# EAGLE schematic project (EAGLE 9.1.3)

## Sheet 1 of 2: Wifi
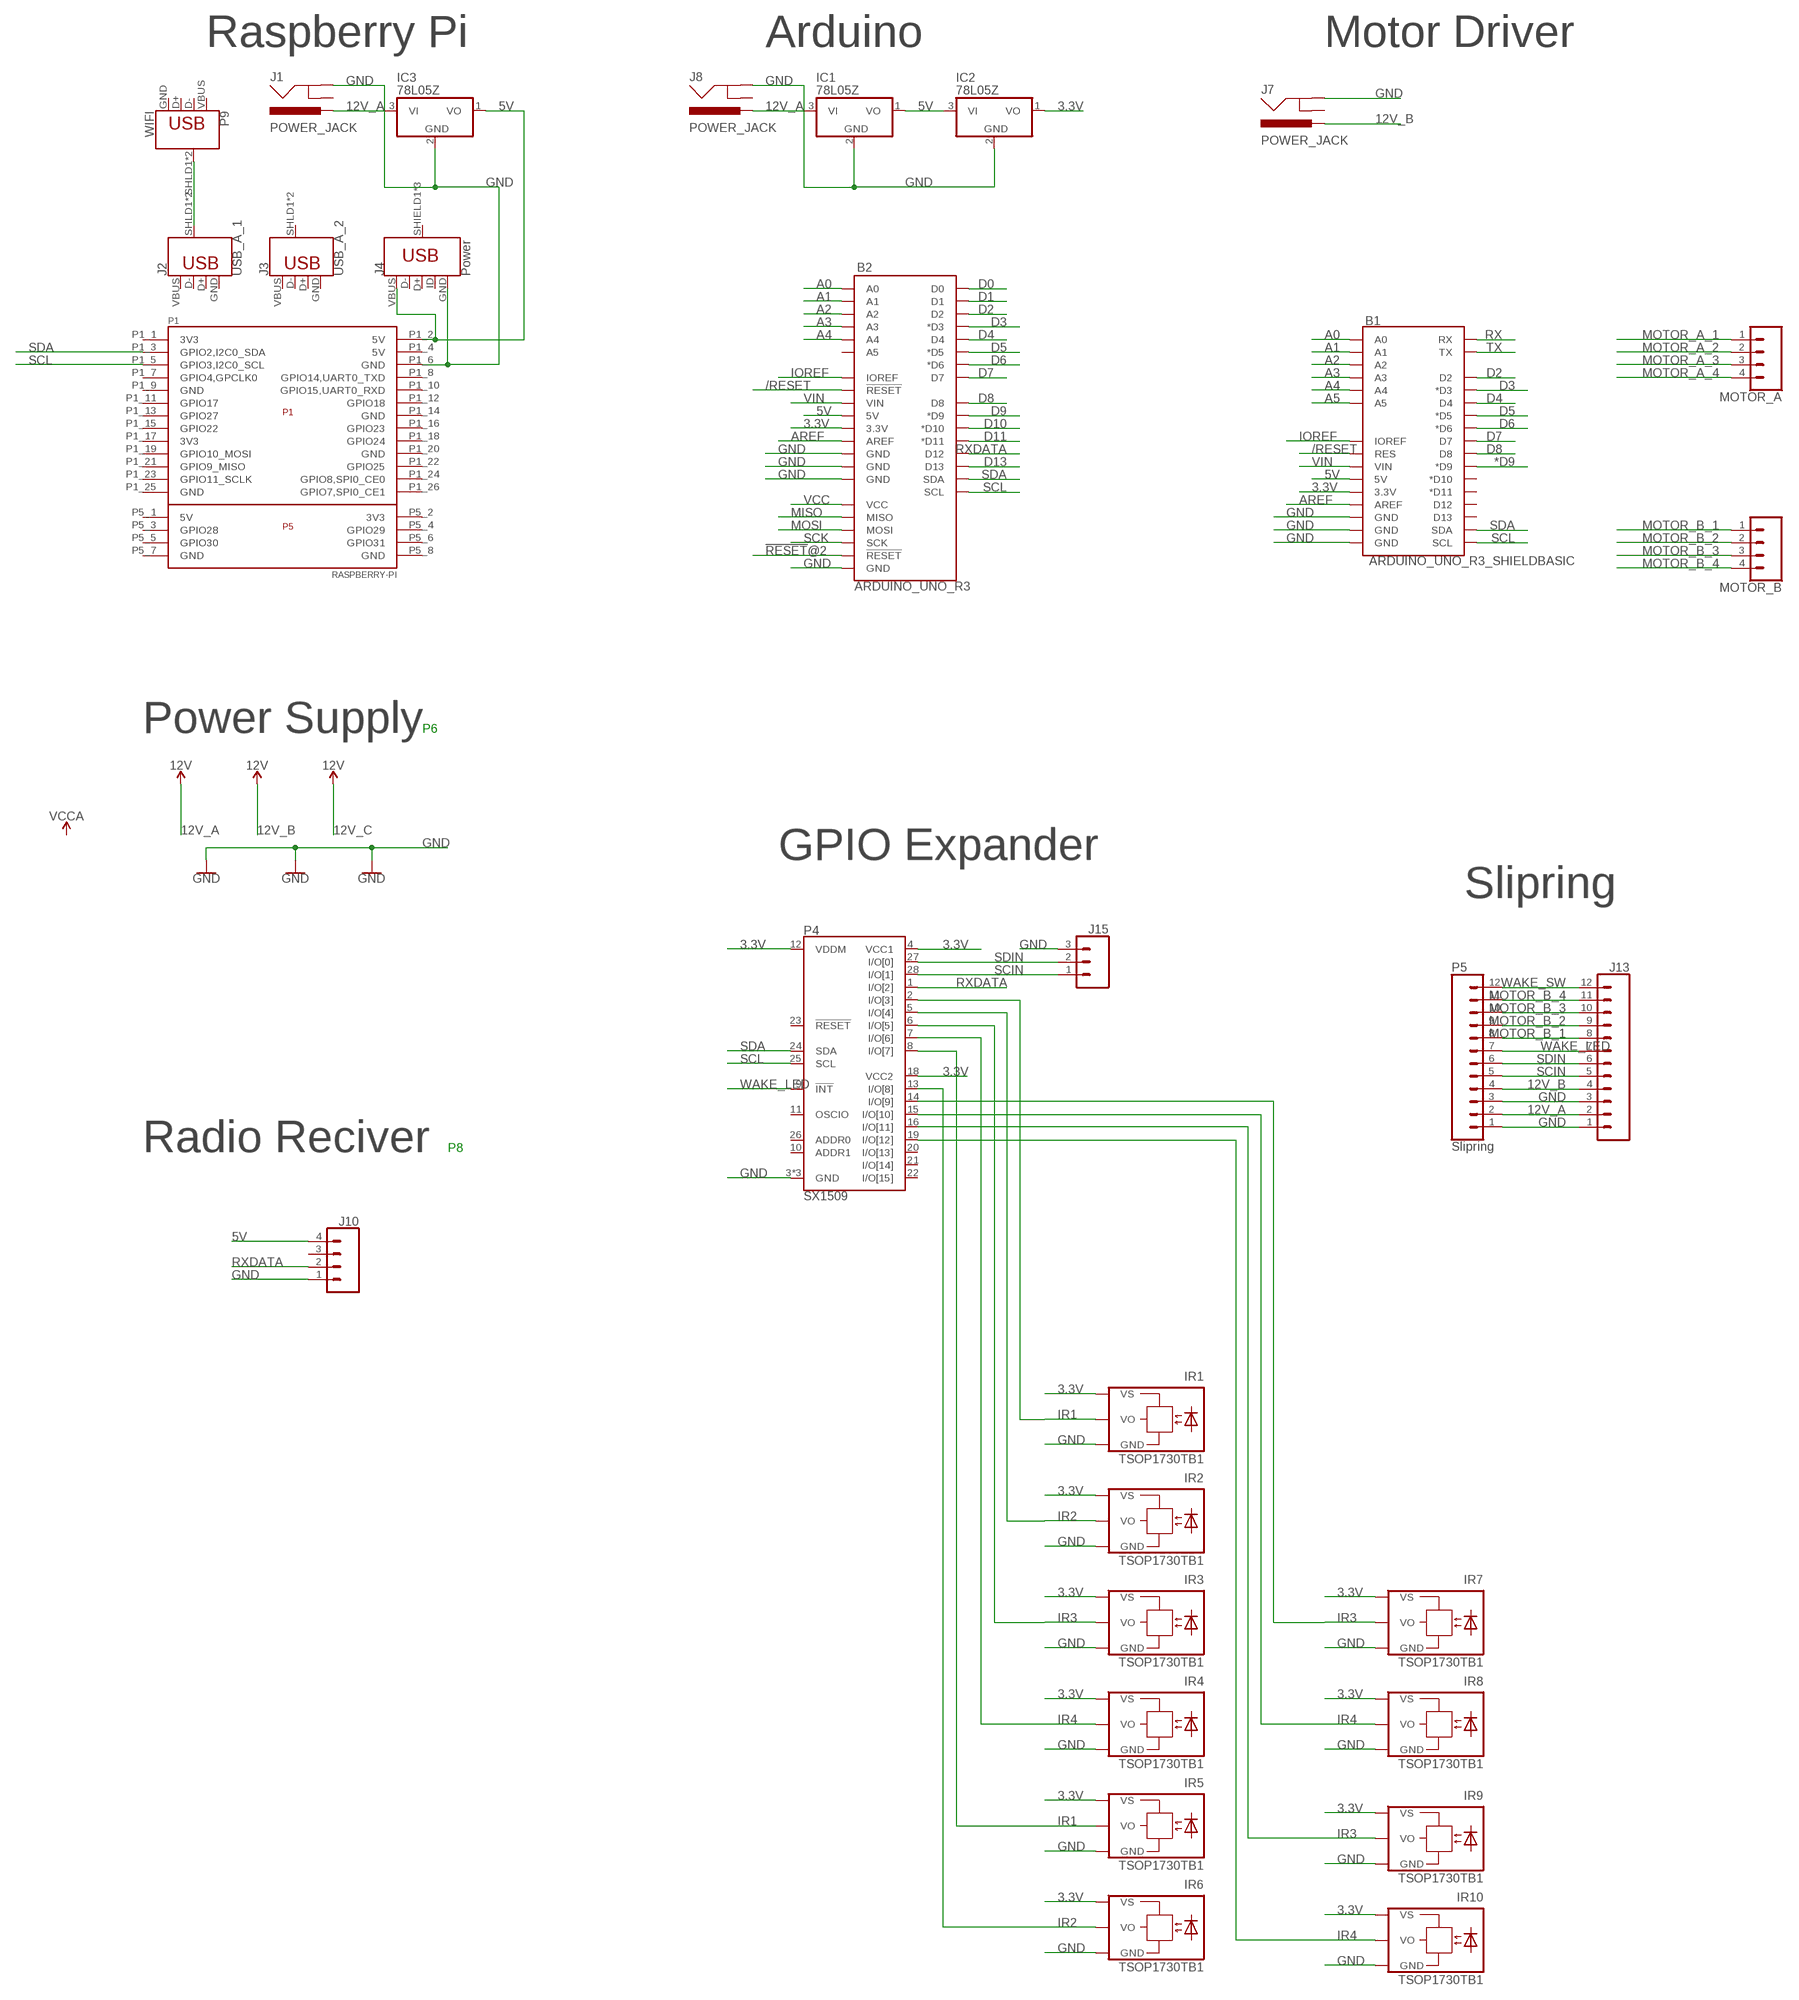
[diagram p0: schematic, sheet 1, part 1 of 2]
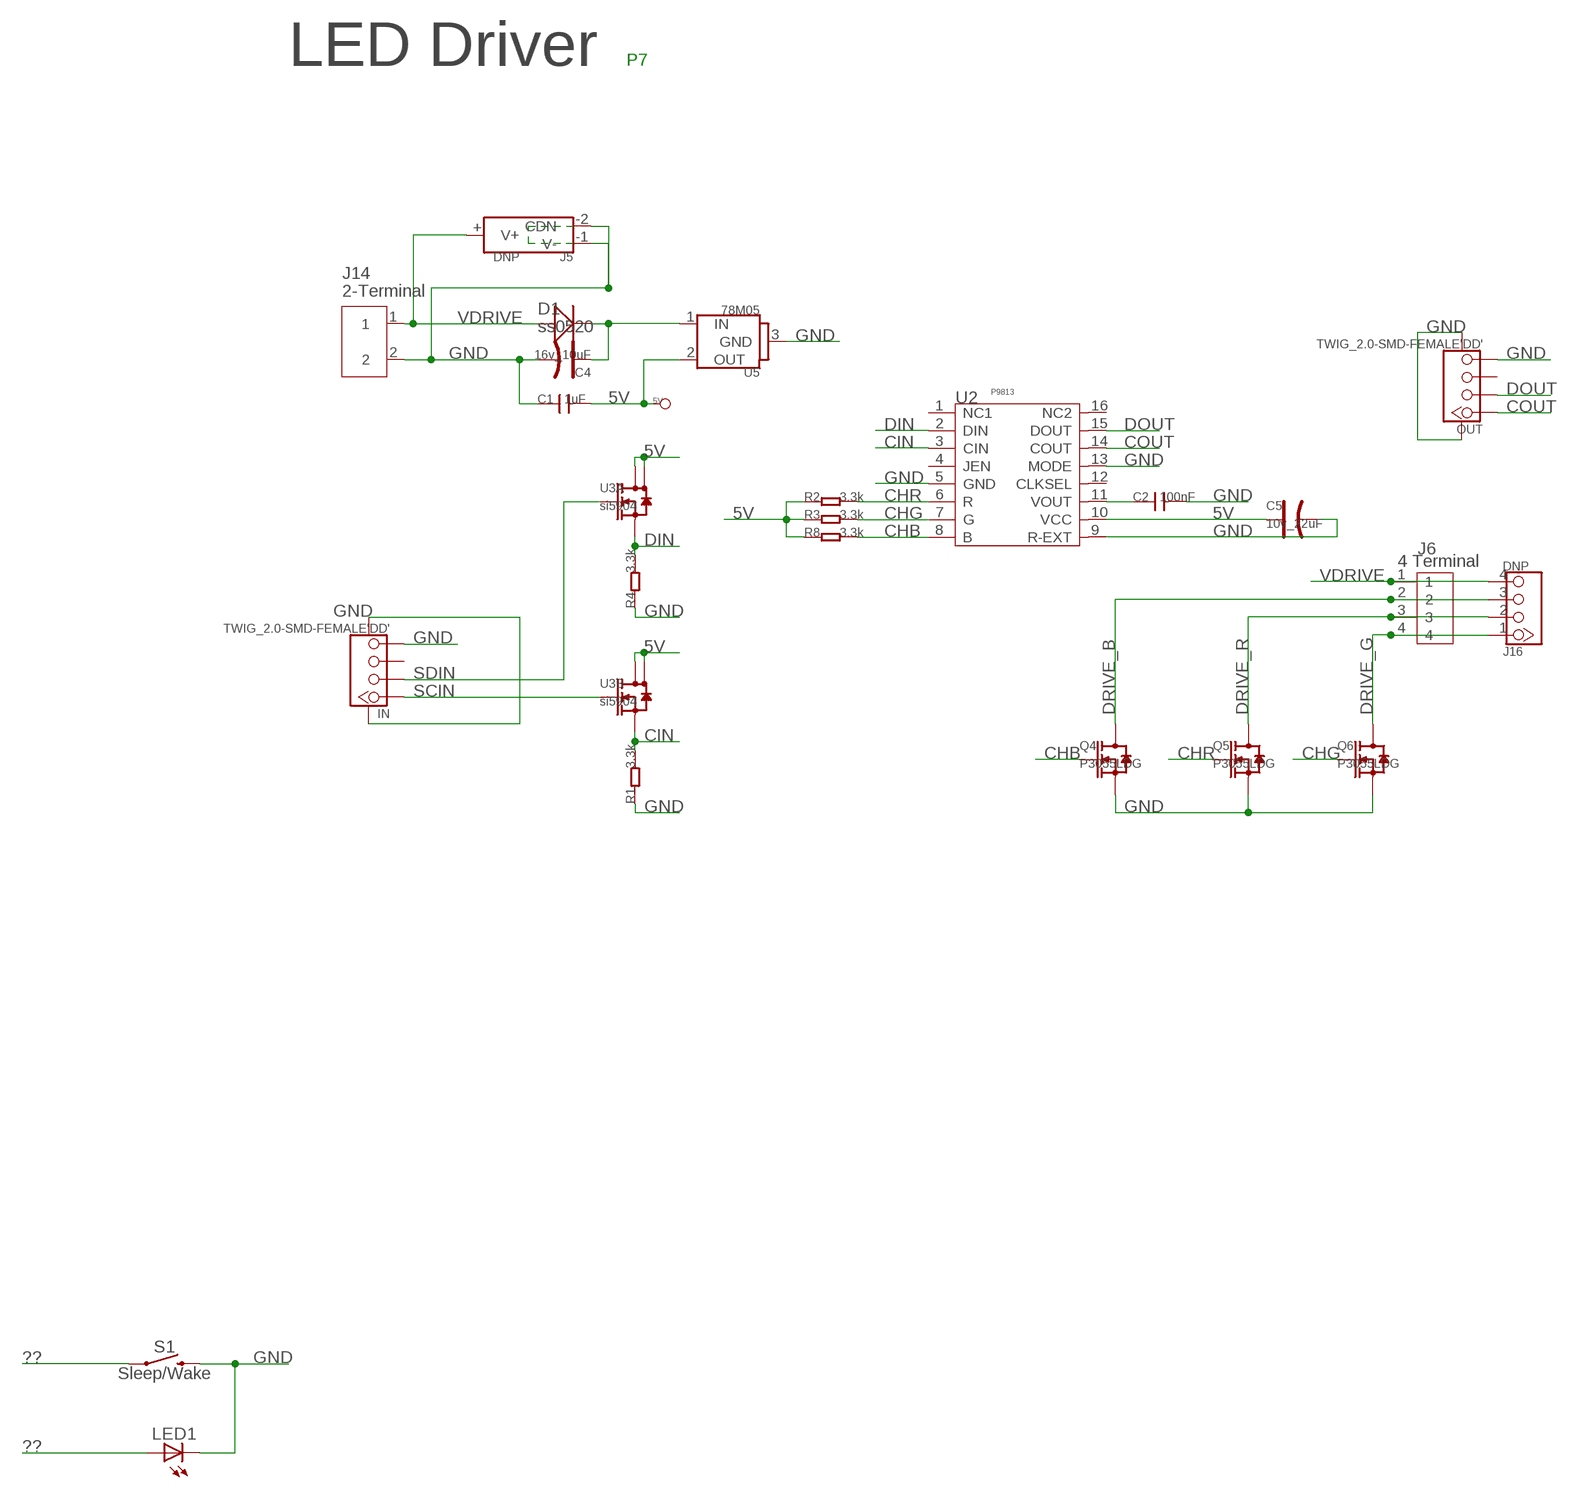
[diagram p1: schematic, sheet 1, part 2 of 2]

### Parts
5V  DNP  PAD-TEST-POINT-CIRCLE_SIZE_3030  [TP_3535]
B1  ARDUINO_UNO_R3_SHIELDBASIC  [UNO_R3_SHIELD]
B2  ARDUINO_UNO_R3  [ARDUINO_R3]
C1  1uF  C-0805  [0805]
C2  100nF  C-0402  [0402]
C4  16v_10uF  CAP-AVX-A  [AVX-A]
C5  10v_22uF  CAP-AVX-A  [AVX-A]
D1  ss0520  D'1206'  [SOD123]
IC1  78L05Z  [TO92]
IC2  78L05Z  [TO92]
IC3  78L05Z  [TO92]
IN  TWIG_2.0-SMD-FEMALE'DD'  [2.0_1X4DD]
IR1  TSOP1730TB1  [TSOP17_TB1]
IR2  TSOP1730TB1  [TSOP17_TB1]
IR3  TSOP1730TB1  [TSOP17_TB1]
IR4  TSOP1730TB1  [TSOP17_TB1]
IR5  TSOP1730TB1  [TSOP17_TB1]
IR6  TSOP1730TB1  [TSOP17_TB1]
IR7  TSOP1730TB1  [TSOP17_TB1]
IR8  TSOP1730TB1  [TSOP17_TB1]
IR9  TSOP1730TB1  [TSOP17_TB1]
IR10  TSOP1730TB1  [TSOP17_TB1]
J1  POWER_JACK  [POWER_JACK_PTH]
J2  USB_A_1  USB_A_SMT_FEMALE  [USB-A-S-SILK-FEMALE]
J3  USB_A_2  USB_A_SMT_FEMALE  [USB-A-S-SILK-FEMALE]
J4  Power  USB_MICRO-B_FEMALE-SMT  [USB-B-MICRO-SMD]
J5  DNP  JACK-3P-2.5MM-2.5MM  [PW-3P-2.5]
J6  4 Terminal  SCREW-TERMINAL-4P'2.54'  [4P-2.54-15.6X12.2X13.2]
J7  POWER_JACK  [POWER_JACK_PTH]
J8  POWER_JACK  [POWER_JACK_PTH]
J10  CONN_04  [1X04]
J13  CONN_12  [1X12]
J14  2-Terminal  SCREW-TERMINAL-2P'2.54'  [2P-2.54-12.1X8.5X13.4]
J15  CONN_03  [1X03]
J16  DNP  HEADER-4P-90D  [4P-2.54-90]
LED1  LED5MM  [LED5MM]
MOTOR_A  CONN_04SCREW  [SCREWTERMINAL-3.5MM-4]
MOTOR_B  CONN_04SCREW  [SCREWTERMINAL-3.5MM-4]
OUT  TWIG_2.0-SMD-FEMALE'DD'  [2.0_1X4DD]
P1  RASPBERRY-PI  RASPBERRY-PI_REV2  [RASPBERRY-PI_REV2]
P4  SX1509  [QFN-28]
P5  Slipring  CONN_12  [1X12]
P9  WIFI  USB_A_PTH_MALE  [USB-A-H]
Q4  P3055LDG  MOSFET-N-P3055LDG  [TO252]
Q5  P3055LDG  MOSFET-N-P3055LDG  [TO252]
Q6  P3055LDG  MOSFET-N-P3055LDG  [TO252]
R1  3.3k  R-0402  [0402]
R2  3.3k  R-0402  [0402]
R3  3.3k  R-0402  [0402]
R4  3.3k  R-0402  [0402]
R8  3.3k  R-0402  [0402]
S1  Sleep/Wake  MOMENTARY-SWITCH-SPST-PTH-6.0MM  [TACTILE_SWITCH_PTH_6.0MM]
U2  P9813  P9813-SSOP16  [SSOP16]
U3  si5904  MOSFET-DUAL-N-1206-8  [1206-8]
U5  78M05  78M05-TO252  [TO252]

### Nets
3.3V: B1.3.3V B2.3.3V IC2.1(VO) IR1.VS IR2.VS IR3.VS IR4.VS IR5.VS IR6.VS IR7.VS IR8.VS IR9.VS IR10.VS P4.4(VCC1) P4.12(VDDM) P4.18(VCC2)
5V: 5V.T B1.5V B2.5V C1.2 C5.+ IC1.1(VO) IC2.3(VI) IC3.1(VO) J4.VBUS J10.4 P1.P1_2(5V) R2.1 R3.1 R8.1 U2.10(VCC) U3.5(B:D) U3.6(B:D) U3.7(A:D) U3.8(A:D) U5.2(OUT)
12V_A: IC1.3(VI) IC3.3(VI) J1.PWR J8.PWR J13.2 P5.2 ; supply symbol labelled 12V
12V_B: J7.PWR J13.4 P5.4 ; supply symbol labelled 12V
!RESET!@2: B2.RESET@2(!RESET!)
*D9: B1.D9(*D9)
/RESET: B1.RES B2.RESET@1(!RESET!)
??: LED1.A S1.1
A0: B1.A0 B2.A0
A1: B1.A1 B2.A1
A2: B1.A2 B2.A2
A3: B1.A3 B2.A3
A4: B1.A4 B2.A4
A5: B1.A5
AREF: B1.AREF B2.AREF
CHB: Q4.1(G) R8.2 U2.8(B)
CHG: Q6.1(G) R3.2 U2.7(G)
CHR: Q5.1(G) R2.2 U2.6(R)
CIN: R1.2 U2.3(CIN) U3.3(B:S)
COUT: OUT.1 U2.14(COUT)
D0: B2.D0
D1: B2.D1
D2: B1.D2 B2.D2
D3: B1.D3(*D3) B2.D3(*D3)
D4: B1.D4 B2.D4
D5: B1.D5(*D5) B2.D5(*D5)
D6: B1.D6(*D6) B2.D6(*D6)
D7: B1.D7 B2.D7
D8: B1.D8 B2.D8
D9: B2.D9(*D9)
D10: B2.D10(*D10)
D11: B2.D11(*D11)
D13: B2.D13
DIN: R4.2 U2.2(DIN) U3.1(A:S)
DOUT: OUT.2 U2.15(DOUT)
DRIVE_B: J6.2 J16.3 Q4.2(D)
DRIVE_G: J6.4 J16.1 Q6.2(D)
DRIVE_R: J6.3 J16.2 Q5.2(D)
GND: B1.GND@0(GND) B1.GND@1(GND) B1.GND@2(GND) B2.GND@1(GND) B2.GND@2(GND) B2.GND@3(GND) B2.GND@4(GND) C1.1 C2.2 C4.- C5.- IC1.2(GND) IC2.2(GND) IC3.2(GND) IN.4 IN.SS1 IN.SS2 IR1.GND IR2.GND IR3.GND IR4.GND IR5.GND IR6.GND IR7.GND IR8.GND IR9.GND IR10.GND J1.GND J4.GND J5.-1(V-) J5.-2(CDN) J7.GND J8.GND J10.1 J13.1 J13.3 J14.2 J15.3 LED1.K(C) OUT.4 OUT.SS1 OUT.SS2 P1.P1_6(GND) P4.3(GND) P4.17(GND) P4.29(GND) P5.1 P5.3 Q4.3(S) Q5.3(S) Q6.3(S) R1.1 R4.1 S1.3 U2.5(GND) U2.9(R-EXT) U2.13(MODE) U5.3(GND)
IOREF: B1.IOREF B2.IOREF
IR1: IR1.VO IR5.VO P4.2(I/O[3]) P4.8(I/O[7])
IR2: IR2.VO IR6.VO P4.5(I/O[4]) P4.13(I/O[8])
IR3: IR3.VO IR7.VO IR9.VO P4.6(I/O[5]) P4.14(I/O[9]) P4.16(I/O[11])
IR4: IR4.VO IR8.VO IR10.VO P4.7(I/O[6]) P4.15(I/O[10]) P4.19(I/O[12])
MISO: B2.MISO
MOSI: B2.MOSI
MOTOR_A_1: MOTOR_A.1
MOTOR_A_2: MOTOR_A.2
MOTOR_A_3: MOTOR_A.3
MOTOR_A_4: MOTOR_A.4
MOTOR_B_1: J13.8 MOTOR_B.1 P5.8
MOTOR_B_2: J13.9 MOTOR_B.2 P5.9
MOTOR_B_3: J13.10 MOTOR_B.3 P5.10
MOTOR_B_4: J13.11 MOTOR_B.4 P5.11
N$1: J2.SHLD1(SHIELD) J2.SHLD2(SHIELD) P9.SHLD1(SHIELD) P9.SHLD2(SHIELD)
N$11: C2.1 U2.11(VOUT)
N$12: C4.+ D1.- U5.1(IN)
RX: B1.RX
RXDATA: B2.D12 J10.2 P4.1(I/O[2])
SCIN: IN.1 J13.5 J15.1 P4.28(I/O[1]) P5.5 U3.4(B:G)
SCK: B2.SCK
SCL: B1.SCL B2.SCL P1.P1_5(GPIO3,I2C0_SCL) P4.25(SCL)
SDA: B1.SDA B2.SDA P1.P1_3(GPIO2,I2C0_SDA) P4.24(SDA)
SDIN: IN.2 J13.6 J15.2 P4.27(I/O[0]) P5.6 U3.2(A:G)
TX: B1.TX
VCC: B2.VCC
VDRIVE: D1.+ J5.+(V+) J6.1 J14.1 J16.4
VIN: B1.VIN B2.VIN
WAKE_LED: J13.7 P4.9(!INT) P5.7
WAKE_SW: J13.12 P5.12
Unconnected: B1.D10(*D10) B1.D11(*D11) B1.D12 B1.D13 B2.A5 IN.3 J1.GNDBREAK J2.D+ J2.D- J3.D+ J3.D- J3.SHLD1(SHIELD) J3.SHLD2(SHIELD) J4.D+ J4.D- J4.ID J4.SHIELD1(SHIELD) J4.SHIELD2(SHIELD) J4.SHIELD3(SHIELD) J7.GNDBREAK J8.GNDBREAK J10.3 OUT.3 P1.P1_1(3V3) P1.P1_4(5V) P1.P1_7(GPIO4,GPCLK0) P1.P1_8(GPIO14,UART0_TXD) P1.P1_9(GND) P1.P1_10(GPIO15,UART0_RXD) P1.P1_11(GPIO17) P1.P1_12(GPIO18) P1.P1_13(GPIO27) P1.P1_14(GND) P1.P1_15(GPIO22) P1.P1_16(GPIO23) P1.P1_17(3V3) P1.P1_18(GPIO24) P1.P1_19(GPIO10_MOSI) P1.P1_20(GND) P1.P1_21(GPIO9_MISO) P1.P1_22(GPIO25) P1.P1_23(GPIO11_SCLK) P1.P1_24(GPIO8,SPI0_CE0) P1.P1_25(GND) P1.P1_26(GPIO7,SPI0_CE1) P1.P5_1(5V) P1.P5_2(3V3) P1.P5_3(GPIO28) P1.P5_4(GPIO29) P1.P5_5(GPIO30) P1.P5_6(GPIO31) P1.P5_7(GND) P1.P5_8(GND) P4.10(ADDR1) P4.11(OSCIO) P4.20(I/O[13]) P4.21(I/O[14]) P4.22(I/O[15]) P4.23(!RESET) P4.26(ADDR0) P9.D+ P9.D- U2.1(NC1) U2.4(JEN) U2.12(CLKSEL) U2.16(NC2)

### Notes on the sheet
- Raspberry Pi | Arduino | Motor Driver | LED Driver | P7
- Power Supply | P6
- GPIO Expander
- Slipring
- Radio Reciver | P8

## Sheet 2 of 2

## Power pins joined to a net without a drawn wire
GND: J2.GND J3.GND P9.GND
VBUS: J2.VBUS J3.VBUS P9.VBUS

## Library data of the parts
5V = Discrete:PAD-TEST-POINT-CIRCLE
B1 = SparkFun-Boards:ARDUINO_UNO_R3_SHIELD: Arduino R3 Shield Footprint Shield form compatible with the Arduino Uno R3. SparkFun Products: MG2639 Cellular Shield <https://www.sparkfun.com/products/13120> MIDI Shield <https://www.sparkfun.com/products/12898> R3 Stackable Headers Kit <https://www.sparkfun.com/products/11417>
B2 = SparkFun-Boards:ARDUINO_UNO_R3: Arduino R3 Footprint with SPI header Arduino Uno R3 Compatible Footprint. Matches PCB size of the original board. SparkFun Products: SAMD21 Dev Breakout <https://www.sparkfun.com/products/13672> RedBoard <https://www.sparkfun.com/products/12757> R3 Stackable Headers <https://www.sparkfun.com/products/11417>
C1 C2 = Discrete:C*: Ceramic Capacitors
C4 C5 = Discrete:CAP*: Electrolytic Capacitors,Tantalum Capacitors and Super Capacitors
D1 = Discrete:D*
IC1-IC3 = adafruit:78*: Positive VOLTAGE REGULATOR Added bigger pads to the TO-92 package
IN OUT = Connector:TWIG_2.0-SMD-FEMALE
IR1-IR10 = telefunken:TSOP17*TB1: TSOP17..TB1 IR Receiver Modules for Remote Control Systems Source: http://www.vishay.com/docs/82042/82042.pdf; OC_FARNELL: unknown; OC_NEWARK: unknown
J1 J7 J8 = SparkFun-Connectors:POWER_JACK: Power Jack Connector This is the standard 5.5mm barrel jack for power. The PTH is the most common, proven, reliable, footprint. The Slot footprint only works if the mill layer is transmitted to the PCB fab house so be warned. Here are the connectors we sell at SparkFun: DC Barrel Power Jack/Connector <https://www.sparkfun.com/products/119> (PRT-00119) DC Barrel Power Jack/Connector (SMD) <https://www.sparkfun.com/products/12748> (PRT-12748) DC Barrel Jack Adapter - Breadboard Compatible <https://www.sparkfun.com/products/10811> (PRT-10811) It is used on this SparkFun product (and many, many others): SparkFun RedBoard - Programmed with Arduino <https://www.sparkfun.com/products/12757> (DEV-12757) Also, if you need a mating power supply or connector, please check these out: Wall Adapter Power Supply - 9VDC 650mA <https://www.sparkfun.com/products/298> (TOL-00298) DC Barrel Jack Adapter - Male <https://www.sparkfun.com/products/10287> (PRT-10287); PROD_ID: CONN-08197
J2 J3 = SparkFun-Connectors:USB_A: USB-A Connector Male and female variants, as well as PTH and SMT variants SparkFun Products: SparkFun XBee Explorer Dongle <https://www.sparkfun.com/products/11697> PTH Male SparkFun MicroView-USB Programmer <https://www.sparkfun.com/products/12924> SMT Male SparkFun USB Type A Female Breakout <https://www.sparkfun.com/products/12700> SMT Female; PROD_ID: CONN-09520; SF_ID: PRT-09011
J4 = SparkFun-Connectors:USB_MICRO-B: USB Type Micro-B Connector Male/female and PTH/SMT variants SparkFun Products: SparkFun microB USB Breakout <https://www.sparkfun.com/products/12035> SparkFun USB microB Plug Breakout <https://www.sparkfun.com/products/10031> SparkFun ESP8266 Thing <https://www.sparkfun.com/products/13231>; PROD_ID: CONN-11752
J5 = Connector:JACK-3P-2.5MM
J6 = Connector:SCREW-TERMINAL-4P
J10 = SparkFun-Connectors:CONN_04: Multi connection point. Often used as Generic Header-pin footprint for 0.1 inch spaced/style header connections On any of the 0.1 inch spaced packages, you can populate with these: Break Away Headers - Straight <https://www.sparkfun.com/products/116> (PRT-00116) Break Away Male Headers - Right Angle <https://www.sparkfun.com/products/553> (PRT-00553) Female Headers <https://www.sparkfun.com/products/115> (PRT-00115) Break Away Headers - Machine Pin <https://www.sparkfun.com/products/117> (PRT-00117) Break Away Female Headers - Swiss Machine Pin <https://www.sparkfun.com/products/743> (PRT-00743) For SCREWTERMINALS and SPRING TERMINALS visit here: Screw Terimnals on SparkFun.com <https://www.sparkfun.com/search/results?term=Screw+Terminals> (5mm/3.5mm/2.54mm spacing) This device is also useful as a general connection point to wire up your design to another part of your project. Our various solder wires solder well into these plated through hole pads. Hook-Up Wire - Assortment (Stranded, 22 AWG) <https://www.sparkfun.com/products/11375> (PRT-11375) Hook-Up Wire - Assortment (Solid Core, 22 AWG) <https://www.sparkfun.com/products/11367> (PRT-11367) View the entire wire category on our website here <https://www.sparkfun.com/categories/141> Special notes: Molex polarized connector foot print use with SKU : PRT-08231 with associated crimp pins and housings. 1MM SMD Version SKU: PRT-10208; PROD_ID: CONN-09696
J13 P5 = SparkFun-Connectors:CONN_12: Multi connection point. Often used as Generic Header-pin footprint for 0.1 inch spaced/style header connections On any of the 0.1 inch spaced packages, you can populate with these: Break Away Headers - Straight <https://www.sparkfun.com/products/116> (PRT-00116) Break Away Male Headers - Right Angle <https://www.sparkfun.com/products/553> (PRT-00553) Female Headers <https://www.sparkfun.com/products/115> (PRT-00115) Break Away Headers - Machine Pin <https://www.sparkfun.com/products/117> (PRT-00117) Break Away Female Headers - Swiss Machine Pin <https://www.sparkfun.com/products/743> (PRT-00743) For SCREWTERMINALS and SPRING TERMINALS visit here: Screw Terimnals on SparkFun.com <https://www.sparkfun.com/search/results?term=Screw+Terminals> (5mm/3.5mm/2.54mm spacing) This device is also useful as a general connection point to wire up your design to another part of your project. Our various solder wires solder well into these plated through hole pads. Hook-Up Wire - Assortment (Stranded, 22 AWG) <https://www.sparkfun.com/products/11375> (PRT-11375) Hook-Up Wire - Assortment (Solid Core, 22 AWG) <https://www.sparkfun.com/products/11367> (PRT-11367) View the entire wire category on our website here <https://www.sparkfun.com/categories/141> Special notes: Molex polarized connector foot print use with SKU : PRT-08231 with associated crimp pins and housings. 1MM SMD Version SKU: PRT-10208 NOTES ON THE VARIANTS LOCK and LOCK_LONGPADS... This footprint was designed to help hold the alignment of a through-hole component (i.e. 6-pin header) while soldering it into place. You may notice that each hole has been shifted either up or down by 0.005 of an inch from it's more standard position (which is a perfectly straight line). This slight alteration caused the pins (the squares in the middle) to touch the edges of the holes. Because they are alternating, it causes a "brace" to hold the component in place. 0.005 has proven to be the perfect amount of "off-center" position when using our standard breakaway headers. Although looks a little odd when you look at the bare footprint, once you have a header in there, the alteration is very hard to notice. Also,if you push a header all the way into place, it is covered up entirely on the bottom side.
J14 = Connector:SCREW-TERMINAL-2P
J15 = SparkFun-Connectors:CONN_03: Multi connection point. Often used as Generic Header-pin footprint for 0.1 inch spaced/style header connections On any of the 0.1 inch spaced packages, you can populate with these: Break Away Headers - Straight <https://www.sparkfun.com/products/116> (PRT-00116) Break Away Male Headers - Right Angle <https://www.sparkfun.com/products/553> (PRT-00553) Female Headers <https://www.sparkfun.com/products/115> (PRT-00115) Break Away Headers - Machine Pin <https://www.sparkfun.com/products/117> (PRT-00117) Break Away Female Headers - Swiss Machine Pin <https://www.sparkfun.com/products/743> (PRT-00743) Stackable Header - 3 Pin (Female, 0.1") <https://www.sparkfun.com/products/13875> (PRT-13875) For SCREWTERMINALS and SPRING TERMINALS visit here: Screw Terimnals on SparkFun.com <https://www.sparkfun.com/search/results?term=Screw+Terminals> (5mm/3.5mm/2.54mm spacing) This device is also useful as a general connection point to wire up your design to another part of your project. Our various solder wires solder well into these plated through hole pads. Hook-Up Wire - Assortment (Stranded, 22 AWG) <https://www.sparkfun.com/products/11375> (PRT-11375) Hook-Up Wire - Assortment (Solid Core, 22 AWG) <https://www.sparkfun.com/products/11367> (PRT-11367) View the entire wire category on our website here <https://www.sparkfun.com/categories/141> Special notes: Molex polarized connector foot print use with SKU : PRT-08232 with associated crimp pins and housings.
J16 = Connector:HEADER-4P
LED1 = adafruit:LED: LED OSRAM: - CHIPLED LG R971, LG N971, LY N971, LG Q971, LY Q971, LO R971, LY R971 LH N974, LH R974 LS Q976, LO Q976, LY Q976 LO Q996 - Hyper CHIPLED LW Q18S LB Q993, LB Q99A, LB R99A - SideLED LS A670, LO A670, LY A670, LG A670, LP A670 LB A673, LV A673, LT A673, LW A673 LH A674 LY A675 LS A676, LA A676, LO A676, LY A676, LW A676 LS A679, LY A679, LG A679 - Hyper Micro SIDELED® LS Y876, LA Y876, LO Y876, LY Y876 LT Y87S - SmartLED LW L88C, LW L88S LB L89C, LB L89S, LG L890 LS L89K, LO L89K, LY L89K LS L896, LA L896, LO L896, LY L896 - TOPLED LS T670, LO T670, LY T670, LG T670, LP T670 LSG T670, LSP T670, LSY T670, LOP T670, LYG T670 LG T671, LOG T671, LSG T671 LB T673, LV T673, LT T673, LW T673 LH T674 LS T676, LA T676, LO T676, LY T676, LB T676, LH T676, LSB T676, LW T676 LB T67C, LV T67C, LT T67C, LS T67K, LO T67K, LY T67K, LW E67C LS E67B, LA E67B, LO E67B, LY E67B, LB E67C, LV E67C, LT E67C LW T67C LS T679, LY T679, LG T679 LS T770, LO T770, LY T770, LG T770, LP T770 LB T773, LV T773, LT T773, LW T773 LH T774 LS E675, LA E675, LY E675, LS T675 LS T776, LA T776, LO T776, LY T776, LB T776 LHGB T686 LT T68C, LB T68C - Hyper Mini TOPLED® LB M676 - Mini TOPLED Santana® LG M470 LS M47K, LO M47K, LY M47K Source: http://www.osram.convergy.de/
MOTOR_A MOTOR_B = SparkFun-Connectors:CONN_04: Multi connection point. Often used as Generic Header-pin footprint for 0.1 inch spaced/style header connections On any of the 0.1 inch spaced packages, you can populate with these: Break Away Headers - Straight <https://www.sparkfun.com/products/116> (PRT-00116) Break Away Male Headers - Right Angle <https://www.sparkfun.com/products/553> (PRT-00553) Female Headers <https://www.sparkfun.com/products/115> (PRT-00115) Break Away Headers - Machine Pin <https://www.sparkfun.com/products/117> (PRT-00117) Break Away Female Headers - Swiss Machine Pin <https://www.sparkfun.com/products/743> (PRT-00743) For SCREWTERMINALS and SPRING TERMINALS visit here: Screw Terimnals on SparkFun.com <https://www.sparkfun.com/search/results?term=Screw+Terminals> (5mm/3.5mm/2.54mm spacing) This device is also useful as a general connection point to wire up your design to another part of your project. Our various solder wires solder well into these plated through hole pads. Hook-Up Wire - Assortment (Stranded, 22 AWG) <https://www.sparkfun.com/products/11375> (PRT-11375) Hook-Up Wire - Assortment (Solid Core, 22 AWG) <https://www.sparkfun.com/products/11367> (PRT-11367) View the entire wire category on our website here <https://www.sparkfun.com/categories/141> Special notes: Molex polarized connector foot print use with SKU : PRT-08231 with associated crimp pins and housings. 1MM SMD Version SKU: PRT-10208; PROD_ID: 2xCONN-08399; SF_ID: 2xPRT-08084
P1 = RaspberryPi:RASPBERRY-PI_REV2: Raspberry Pi Board <http://www.raspberrypi.org/> Jacques Lagnel V1.0 (beta) 2012 Mateusz Bawaj V1.1 (beta) 2012 Board dimension: Forum 3D model <http://www.raspberrypi.org/forum/general-discussion/mechanical-profile-3d-models?value=3d%20model&type=1&include=1&search=1&ret=all> The GPIO Connector (P1): http://elinux.org/RPi_Low-level_peripherals The GPIO Connector (P5): http://www.raspberrypi-spy.co.uk/2012/09/raspberry-pi-p5-header/
P4 = SparkFun-IC-Special-Function:SX1509: Semtech SX1509 The SX1509 is a complete ultra low voltage 1.2V to 3.6V General Purpose parallel Input/Output (GPIO) expanders ideal for low power handheld battery powered equipment. This version comes in a 16-channel configuration and allows easy serial expansion of I/O through a standard 400kHz I2C interface. GPIO devices can provide additional control and monitoring when the microcontroller or chipset has insufficient I/O ports, or in systems where serial communication and control from a remote location is advantageous. Datasheet <http://cdn.sparkfun.com/datasheets/BreakoutBoards/sx1509.pdf> SparkFun Products SparkFun 16 Output I/O Expander Breakout - SX1509 <https://www.sparkfun.com/products/13601> (BOB-13601) SparkFun Line Follower Array <https://www.sparkfun.com/products/13582> (SEN-13582); PROD_ID: IC-11311
P9 = SparkFun-Connectors:USB_A: USB-A Connector Male and female variants, as well as PTH and SMT variants SparkFun Products: SparkFun XBee Explorer Dongle <https://www.sparkfun.com/products/11697> PTH Male SparkFun MicroView-USB Programmer <https://www.sparkfun.com/products/12924> SMT Male SparkFun USB Type A Female Breakout <https://www.sparkfun.com/products/12700> SMT Female; PROD_ID: CONN-08367; SF_ID: PRT-00437
Q4-Q6 = Discrete:MOSFET-N: IRLL014: http://www.vishay.com/docs/91319/sihll014.pdf
R1-R4 R8 = Discrete:R*
S1 = SparkFun-Switches:MOMENTARY-SWITCH-SPST: Momentary Switch (Pushbutton) - SPST Normally-open (NO) SPST momentary switches (buttons, pushbuttons). Variants PTH-12MM - 12mm square, through-hole Momentary Pushbutton Switch - 12mm Square <https://www.sparkfun.com/products/9190> (COM-09190) PTH-6.0MM, PTH-6.0MM-KIT - 6.0mm square, through-hole Mini Pushbutton Switch <https://www.sparkfun.com/products/97> (COM-00097) KIT package intended for soldering kit's - only one side of pads' copper is exposed. PTH-RIGHT-ANGLE-KIT - Right-angle, through-hole Right Angle Tactile Button <https://www.sparkfun.com/products/10791> - Used on SparkFun BigTime Watch Kit <https://www.sparkfun.com/products/11734> SMD-12MM - 12mm square, surface-mount Tactile Button - SMD (12mm) <https://www.sparkfun.com/products/12993> (COM-12993) Used on SparkFun PicoBoard <https://www.sparkfun.com/products/11888> SMD-4.5MM - 4.5mm Square Trackball Switch Used on SparkFun Blackberry Trackballer Breakout <https://www.sparkfun.com/products/13169> SMD-4.6MMX2.8MM - 4.60mm x 2.80mm, surface mount Used on SparkFun SAMD21 Mini Breakout <https://www.sparkfun.com/products/13664> SMD-5.2MM, SMD-5.2-REDUNDANT - 5.2mm square, surface-mount Mini Pushbutton Switch - SMD <https://www.sparkfun.com/products/8720> (COM-08720) Used on Arduino Pro Mini <https://www.sparkfun.com/products/11114> REDUNDANT package connects both switch circuits together SMD-6.0X3.5MM - 6.0 x 3.5mm, surface mount Momentary Reset Switch SMD <https://www.sparkfun.com/products/8229> (COM-08229) SMD-6.2MM-TALL - 6.2mm square, surface mount Tactile Button - SMD (6mm) <https://www.sparkfun.com/products/12992> Used on SparkFun Digital Sandbox <https://www.sparkfun.com/products/12651> SMD-RIGHT-ANGLE - Right-angle, surface mount Used on SparkFun Block for Intel® Edison - Arduino <https://www.sparkfun.com/products/13036>; PROD_ID: SWCH-08441; SF_SKU: COM-00097
U2 = IC:P9813-SSOP16
U3 = Discrete:MOSFET-DUAL-N: Si5902BDC/Si5904DC/Si5908DC/Si5920DC
U5 = IC:78M05: 0.5A Three Terminal Positive Voltage Regulators http://pdf1.alldatasheet.com/datasheet-pdf/view/31368/TOSHIBA/78M05/+21_79UPLRhpDDdCDytD+/datasheet.pdf